# Altium project fader2_pcb.PrjPcb (part 2 of 2)

## Sheet Supplies_Pots.SchDoc
size 228 x 279 mm
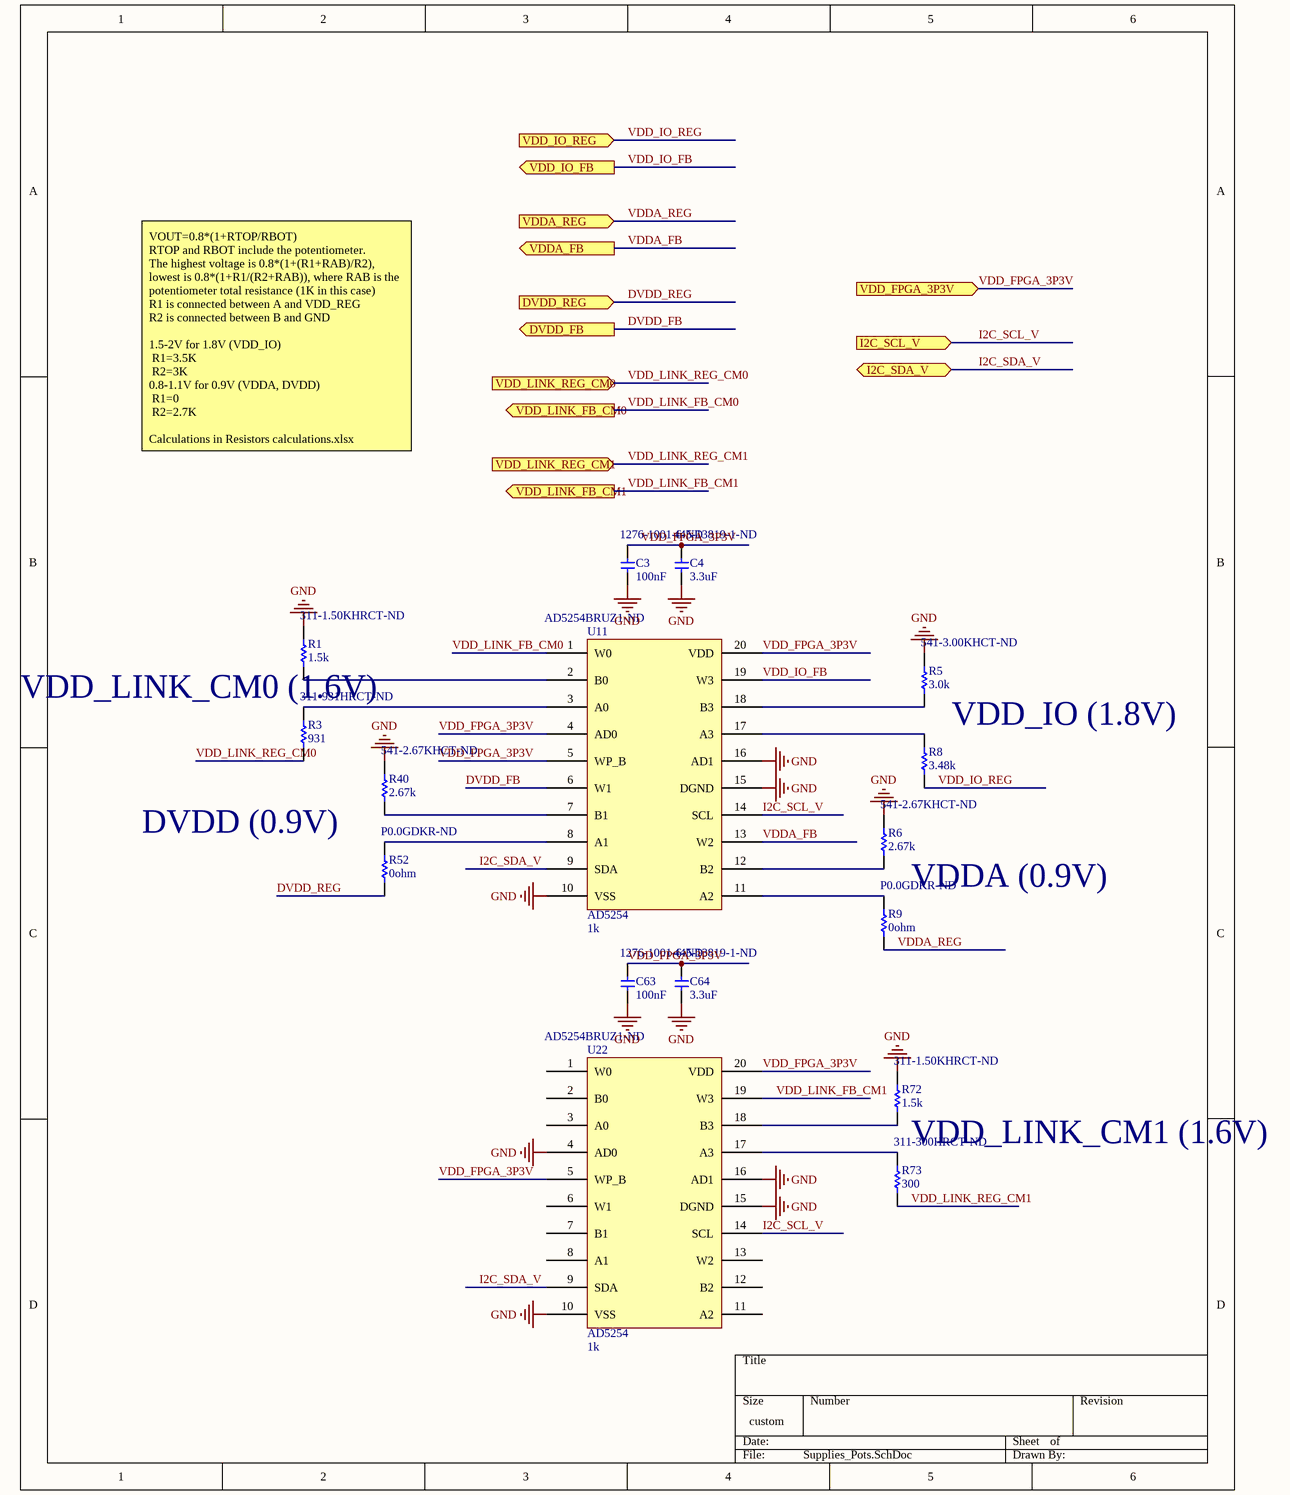
[diagram p9: Supplies_Pots.SchDoc]

### Parts
C3  100nF  Supplier Part Number 1: 1276-1001-6-ND  [CAP_0402]
C4  3.3uF  Supplier Part Number 1: 445-13819-1-ND  [CAP_0402]
C63  100nF  Supplier Part Number 1: 1276-1001-6-ND  [CAP_0402]
C64  3.3uF  Supplier Part Number 1: 445-13819-1-ND  [CAP_0402]
R1  1.5k  Supplier Part Number 1: 311-1.50KHRCT-ND  [RES_0603]
R3  931  Supplier Part Number 1: 311-931HRCT-ND  [RES_0603]
R5  3.0k  Supplier Part Number 1: 541-3.00KHCT-ND  [RES_0603]
R6  2.67k  Supplier Part Number 1: 541-2.67KHCT-ND  [RES_0603]
R8  3.48k  [RES_0603]
R9  0ohm  Supplier Part Number 1: P0.0GDKR-ND  [RES_0603]
R40  2.67k  Supplier Part Number 1: 541-2.67KHCT-ND  [RES_0603]
R52  0ohm  Supplier Part Number 1: P0.0GDKR-ND  [RES_0603]
R72  1.5k  Supplier Part Number 1: 311-1.50KHRCT-ND  [RES_0603]
R73  300  Supplier Part Number 1: 311-300HRCT-ND  [RES_0603]
U11  AD5254  Resistance: 1k  Supplier Part Number 1: AD5254BRUZ1-ND  [AD5254]
U22  AD5254  Resistance: 1k  Supplier Part Number 1: AD5254BRUZ1-ND  [AD5254]

### Ports
DVDD_FB (out), DVDD_REG (in), I2C_SCL_V (in), I2C_SDA_V (bidir), VDD_FPGA_3P3V (in), VDD_IO_FB (out), VDD_IO_REG (in), VDD_LINK_FB_CM0 (out), VDD_LINK_FB_CM1 (out), VDD_LINK_REG_CM0 (in), VDD_LINK_REG_CM1 (in), VDDA_FB (out), VDDA_REG (in)

### Nets
GND: C3.2 C4.2 C63.2 C64.2 R1.1(TOP) R5.1(TOP) R6.1(TOP) R40.1(TOP) R72.1(TOP) U11.10(VSS) U11.15(DGND) U11.16(AD1) U22.4(AD0) U22.10(VSS) U22.15(DGND) U22.16(AD1)
DVDD_FB: U11.6(W1) ; port DVDD_FB
DVDD_REG: R52.2(BOT) ; port DVDD_REG
I2C_SCL_V: U11.14(SCL) U22.14(SCL) ; port I2C_SCL_V
I2C_SDA_V: U11.9(SDA) U22.9(SDA) ; port I2C_SDA_V
VDD_FPGA_3P3V: C3.1 C4.1 C63.1 C64.1 U11.4(AD0) U11.5(WP_B) U11.20(VDD) U22.5(WP_B) U22.20(VDD) ; port VDD_FPGA_3P3V
VDD_IO_FB: U11.19(W3) ; port VDD_IO_FB
VDD_IO_REG: R8.2(BOT) ; port VDD_IO_REG
VDD_LINK_FB_CM0: U11.1(W0) ; port VDD_LINK_FB_CM0  [project net VDD_LINK_FB]
VDD_LINK_FB_CM1: U22.19(W3) ; port VDD_LINK_FB_CM1
VDD_LINK_REG_CM0: R3.2(BOT) ; port VDD_LINK_REG_CM0
VDD_LINK_REG_CM1: R73.2(BOT) ; port VDD_LINK_REG_CM1
VDDA_FB: U11.13(W2) ; port VDDA_FB
VDDA_REG: R9.2(BOT) ; port VDDA_REG
NetR1_2: R1.2(BOT) U11.2(B0)
NetR3_1: R3.1(TOP) U11.3(A0)
NetR5_2: R5.2(BOT) U11.18(B3)
NetR6_2: R6.2(BOT) U11.12(B2)
NetR8_1: R8.1(TOP) U11.17(A3)
NetR9_1: R9.1(TOP) U11.11(A2)
NetR40_2: R40.2(BOT) U11.7(B1)
NetR52_1: R52.1(TOP) U11.8(A1)
NetR72_2: R72.2(BOT) U22.18(B3)
NetR73_1: R73.1(TOP) U22.17(A3)

Not connected (* = marked no-connect by the designer): U22 1(W0) 2(B0) 3(A0) 6(W1) 7(B1) 8(A1) 11(A2) 12(B2) 13(W2)

### Notes on the sheet
- VOUT=0.8*(1+RTOP/RBOT)
  RTOP and RBOT include the potentiometer.
  The highest voltage is 0.8*(1+(R1+RAB)/R2), lowest is 0.8*(1+R1/(R2+RAB)), where RAB is the potentiometer total resistance (1K in this case)
  R1 is connected between A and VDD_REG
  R2 is connected between B and GND
  1.5-2V for 1.8V (VDD_IO)
  R1=3.5K
  R2=3K
  0.8-1.1V for 0.9V (VDDA, DVDD)
  R1=0
  R2=2.7K
  Calculations in Resistors calculations.xlsx
- (near R1) VDD_LINK_CM0 (1.6V)
- VDD_IO (1.8V)
- DVDD (0.9V)
- VDDA (0.9V)
- VDD_LINK_CM1 (1.6V)

### Library data of the parts
C3 C63 = cap 100nF: CAP CER 0.1uF 10% 16V X7R 0402; Manufacturer: Samsung Electro-Mechanics; Manufacturer ID: CL05B104KO5NNNC; Digikey ID: 1276-1001-1-ND; Value: 0.1uF; Package: 0402; Supplier 1: Digi-Key
C4 C64 = cap 3p3uF: CAP CER 3.3uF 10% 10V X5R 0402; Manufacturer: TDK; Manufacturer ID: C1005X5R1A335K050BC; Digikey ID: 445-13819-1-ND; Value: 3.3uF; Package: 0402; Supplier 1: Digi-Key
R1 R72 = res 1.5 kOhm_1: RES SMD 1.5K OHM 1% 1/10W 0603; Package: 0603; Supplier 1: Digi-Key; Supplier 2: Arrow; Supplier Part Number 2: CRCW06031K50FKEA
R3 = res 931 Ohm_1: RES SMD 931 OHM 1% 1/10W 0603; Package: 0603; Supplier 1: Digi-Key; Supplier 2: Digi-Key; Supplier Part Number 2: 541-931HCT-ND
R5 = res 3 kOhm_1: RES SMD 3k OHM 1% 1/10W 0603; Package: 0603; Supplier 1: Digi-Key; Supplier 2: Digi-Key; Supplier Part Number 2: 311-3.00KHRCT-ND
R6 R40 = res 2.67 kOhm_1: RES SMD 2.67kOHM 1% 1/10W 0603; Package: 0603; Supplier 1: Digi-Key; Supplier 2: Digi-Key; Supplier Part Number 2: 311-2.67KHRCT-ND
R8 = res 3.48 kOhm_1: RES SMD 3.48kOHM 1% 1/10W 0603; Package: 0603; Supplier 1: Digi-Key; Supplier Part Number 1: 311-3.48KHRCT-ND; Supplier 2: Digi-Key; Supplier Part Number 2: 541-3.48KHCT-ND
R9 R52 = res 0 ohm 0603: RES SMD 0 OHM JUMPER 1/10W 0603; Manufacturer: Panasonic; Manufacturer ID: ERJ-3GEY0R00V; Digikey ID: P0.0GCT-ND; Package: 0603; Supplier 1: Digi-Key
R73 = res 300 Ohm_1: RES SMD 300 OHM 1% 1/10W 0603; Package: 0603; Supplier 1: Digi-Key; Supplier 2: Digi-Key; Supplier Part Number 2: 541-300HCT-ND
U11 U22 = AD5254: Digital Potentiometer 1k Ohm 4 Circuit 256 Taps I²C Interface 20-TSSOP; Manufacturer: Analog Devices; Manufacturer ID: AD5254BRUZ1; Digikey ID: AD5254BRUZ1-ND; Supplier 1: Digi-Key

## Sheet De_Embed.SchDoc
size A
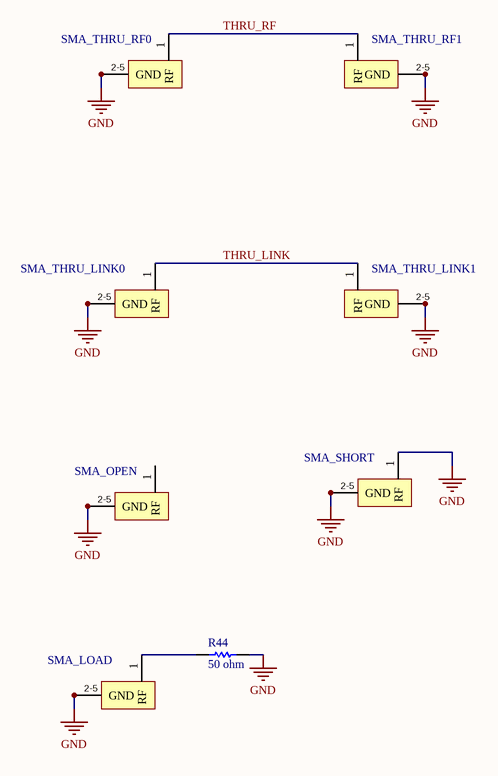
[diagram p10: De_Embed.SchDoc]

### Parts
R44  50 ohm  [RES_0402]
SMA_LOAD  CONSMA001-SMD-G  [CON-SMA-SMD]  (value not drawn)
SMA_OPEN  CONSMA001-SMD-G  [CON-SMA-SMD]  (value not drawn)
SMA_SHORT  CONSMA001-SMD-G  [CON-SMA-SMD]  (value not drawn)
SMA_THRU_LINK0  CONSMA001-SMD-G  [CON-SMA-SMD]  (value not drawn)
SMA_THRU_LINK1  CONSMA001-SMD-G  [CON-SMA-SMD]  (value not drawn)
SMA_THRU_RF0  CONSMA001-SMD-G  [CON-SMA-SMD]  (value not drawn)
SMA_THRU_RF1  CONSMA001-SMD-G  [CON-SMA-SMD]  (value not drawn)

### Nets
GND: R44.2(BOT) SMA_LOAD.2(GND) SMA_LOAD.3(GND) SMA_LOAD.4(GND) SMA_LOAD.5(GND) SMA_OPEN.2(GND) SMA_OPEN.3(GND) SMA_OPEN.4(GND) SMA_OPEN.5(GND) SMA_SHORT.1(RF) SMA_SHORT.2(GND) SMA_SHORT.3(GND) SMA_SHORT.4(GND) SMA_SHORT.5(GND) SMA_THRU_LINK0.2(GND) SMA_THRU_LINK0.3(GND) SMA_THRU_LINK0.4(GND) SMA_THRU_LINK0.5(GND) SMA_THRU_LINK1.2(GND) SMA_THRU_LINK1.3(GND) SMA_THRU_LINK1.4(GND) SMA_THRU_LINK1.5(GND) SMA_THRU_RF0.2(GND) SMA_THRU_RF0.3(GND) SMA_THRU_RF0.4(GND) SMA_THRU_RF0.5(GND) SMA_THRU_RF1.2(GND) SMA_THRU_RF1.3(GND) SMA_THRU_RF1.4(GND) SMA_THRU_RF1.5(GND)
THRU_LINK: SMA_THRU_LINK0.1(RF) SMA_THRU_LINK1.1(RF)
THRU_RF: SMA_THRU_RF0.1(RF) SMA_THRU_RF1.1(RF)
NetR44_1: R44.1(TOP) SMA_LOAD.1(RF)

Not connected (* = marked no-connect by the designer): SMA_OPEN 1(RF)

### Notes on the sheet
- (in symbol SURFACE MOUNT SMA CONNECTOR) 2-5

### Library data of the parts
R44 = res 50 ohm 0402: RES SMD 50 OHM 0.1% 1/20W 0402; Manufacturer: Vishay; Manufacturer ID: FC0402E50R0BST1; Package: 0402; Supplier 1: Digi-Key; Supplier Part Number 1: FC0402-50BWCT-ND; Resistance: 50 Ohm
SMA_LOAD SMA_OPEN SMA_SHORT SMA_THRU_LINK0 SMA_THRU_LINK1 SMA_THRU_RF0 SMA_THRU_RF1 = SURFACE MOUNT SMA CONNECTOR: SMD SMA CONNECTOR; Manufacturer 1: Linx Technologies; Supplier 1: Digi-Key; Supplier Part Number 1: CONSMA001-SMD-ND; Manufacturer Part Number 1: CONSMA001-SMD-G; Manufacturer Part Number 2: CONSMA002-SMD; Supplier Part Number 2: CONSMA002-SMD-ND

## Sheet BB_analog.SchDoc
size A
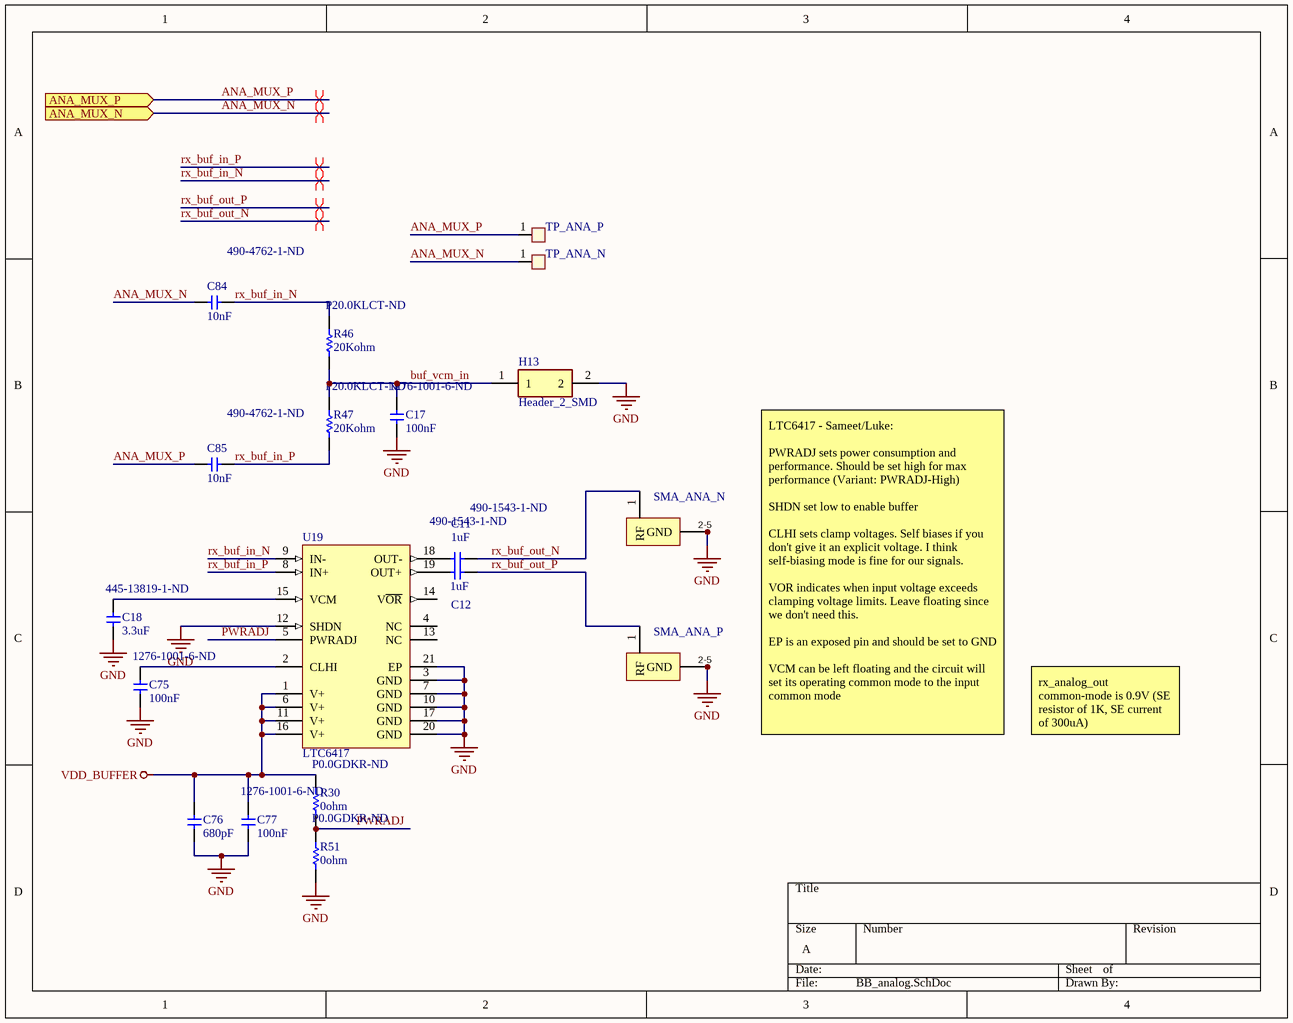
[diagram p11: BB_analog.SchDoc]

### Parts
C11  1uF  Supplier Part Number 1: 490-1543-1-ND  [CAP_0603]
C12  1uF  Supplier Part Number 1: 490-1543-1-ND  [CAP_0603]
C17  100nF  Supplier Part Number 1: 1276-1001-6-ND  [CAP_0402]
C18  3.3uF  Supplier Part Number 1: 445-13819-1-ND  [CAP_0402]
C75  100nF  Supplier Part Number 1: 1276-1001-6-ND  [CAP_0402]
C76  680pF  [CAP_0603]
C77  100nF  Supplier Part Number 1: 1276-1001-6-ND  [CAP_0402]
C84  10nF  Supplier Part Number 1: 490-4762-1-ND  [CAPC1005X06L_HD]
C85  10nF  Supplier Part Number 1: 490-4762-1-ND  [CAPC1005X06L_HD]
H13  Header_2_SMD  [HDR1X2_SMD_S]
R30  0ohm  Supplier Part Number 1: P0.0GDKR-ND  [RES_0603]
R46  20Kohm  Supplier Part Number 1: P20.0KLCT-ND  [RES_0402]
R47  20Kohm  Supplier Part Number 1: P20.0KLCT-ND  [RES_0402]
R51  0ohm  Supplier Part Number 1: P0.0GDKR-ND  [RES_0603]
SMA_ANA_N  CONSMA001-SMD-G  [CON-SMA-SMD]  (value not drawn)
SMA_ANA_P  CONSMA001-SMD-G  [CON-SMA-SMD]  (value not drawn)
TP_ANA_N  TestPoint_SMD  [TestPoint_SMD]  (value not drawn)
TP_ANA_P  TestPoint_SMD  [TestPoint_SMD]  (value not drawn)
U19  LTC6417  [LT-UDC-20_N_NPV]

### Ports
ANA_MUX_N (in), ANA_MUX_P (in)

### Nets
GND: C17.2 C18.2 C75.2 C76.2 C77.2 H13.2 R51.2(BOT) SMA_ANA_N.2(GND) SMA_ANA_N.3(GND) SMA_ANA_N.4(GND) SMA_ANA_N.5(GND) SMA_ANA_P.2(GND) SMA_ANA_P.3(GND) SMA_ANA_P.4(GND) SMA_ANA_P.5(GND) U19.3(GND) U19.7(GND) U19.10(GND) U19.12(SHDN) U19.17(GND) U19.20(GND) U19.21(EP)
VDD_BUFFER: C76.1 C77.1 R30.1(TOP) U19.1(V+) U19.6(V+) U19.11(V+) U19.16(V+)
ANA_MUX_N: C84.1 TP_ANA_N.1(TP) ; port ANA_MUX_N
ANA_MUX_P: C85.1 TP_ANA_P.1(TP) ; port ANA_MUX_P
buf_vcm_in: C17.1 H13.1 R46.2(BOT) R47.1(TOP)
PWRADJ: R30.2(BOT) R51.1(TOP) U19.5(PWRADJ)
rx_buf_in_N: C84.2 R46.1(TOP) U19.9(IN-)
rx_buf_in_P: C85.2 R47.2(BOT) U19.8(IN+)
rx_buf_out_N: C11.2 SMA_ANA_N.1(RF)
rx_buf_out_P: C12.1 SMA_ANA_P.1(RF)
NetC11_1: C11.1 U19.18(OUT-)
NetC12_2: C12.2 U19.19(OUT+)
NetC18_1: C18.1 U19.15(VCM)
NetC75_1: C75.1 U19.2(CLHI)

Not connected (* = marked no-connect by the designer): U19 4(NC) 13(NC) 14(V~{OR})

### Layout directives
differential pair: ANA_MUX_N, ANA_MUX_P, rx_buf_in_N, rx_buf_in_P, rx_buf_out_N, rx_buf_out_P

### Notes on the sheet
- LTC6417 - Sameet/Luke:
  PWRADJ sets power consumption and performance. Should be set high for max performance (Variant: PWRADJ-High)
  SHDN set low to enable buffer
  CLHI sets clamp voltages. Self biases if you don't give it an explicit voltage. I think self-biasing mode is fine for our signals.
  VOR indicates when input voltage exceeds clamping voltage limits. Leave floating since we don't need this.
  EP is an exposed pin and should be set to GND
  VCM can be left floating and the circuit will set its operating common mode to the input common mode
- rx_analog_out common-mode is 0.9V (SE resistor of 1K, SE current of 300uA)
- (in symbol SURFACE MOUNT SMA CONNECTOR) 2-5

### Library data of the parts
C11 C12 = cap 1uF 0603: CAP CER 1uF 10% 10V X5R 0603; Manufacturer: Murata; Manufacturer ID: GRM188R61A105KA61D; Digikey ID: 490-1543-1-ND; Value: 1uF; Package: 0603; Supplier 1: Digi-Key
C17 C75 C77 = cap 100nF: as C3 on sheet Supplies_Pots; Digikey ID: 1276-1001-1-ND; Value: 0.1uF; Package: 0402; Supplier 1: Digi-Key
C18 = cap 3p3uF: as C4 on sheet Supplies_Pots; Digikey ID: 445-13819-1-ND; Value: 3.3uF; Package: 0402; Supplier 1: Digi-Key
C76 = cap 680pF 0603: CAP CER 680pF 5% 25V C0G/NP0 0603; Manufacturer: Kemet; Manufacturer ID: C0603C681J3GACTU; Package: 0603; Supplier 1: Digi-Key; Supplier Part Number 1: 399-7949-1-ND; Capacitance: 680pF
C84 C85 = cap 10nF: CAP CER 10nF 10% 50V X7R 0402; Manufacturer: Murata; Manufacturer ID: GCM155R71H103KA55D; Value: 10000pF; Digikey ID: 490-4762-1-ND; Package: 0402; Supplier 1: Digi-Key
H13 = Header_2_SMD: Connector Header Vertical, SMD, 2 position 0.100" (2.54mm); Manufacturer_Name: SAMTEC; Manufacturer_Part_Number: TSM-102-01-S-SV; Datasheet Link: https://componentsearchengine.com/Datasheets/2/TSM-102-01-S-SV.pdf; Arrow Part Number: TSM-102-01-S-SV; Arrow Price/Stock: https://www.arrow.com/en/products/tsm-102-01-s-sv/samtec; Mouser Part Number: 200-TSM10201SSV; Mouser Price/Stock: https://www.mouser.co.uk/ProductDetail/Samtec/TSM-102-01-S-SV?qs=FESYatJ8odJNSemiJZ%2Fyzw%3D%3D; Supplier 1: Digi-Key; Supplier Part Number 1: SAM10783-ND
R30 R51 = res 0 ohm 0603: as R9 on sheet Supplies_Pots; Digikey ID: P0.0GCT-ND; Package: 0603; Supplier 1: Digi-Key
R46 R47 = res 20 Kohm: RES SMD 20k OHM 1% 1/10W 0402; Manufacturer: Panasonic; Manufacturer ID: ERJ-2RKF2002X; Digikey ID: P20.0KLCT-ND; Package: 0402; Supplier 1: Digi-Key
SMA_ANA_N SMA_ANA_P = SURFACE MOUNT SMA CONNECTOR: as SMA_LOAD on sheet De_Embed; Supplier 1: Digi-Key; Supplier Part Number 1: CONSMA001-SMD-ND; Manufacturer Part Number 1: CONSMA001-SMD-G; Manufacturer Part Number 2: CONSMA002-SMD; Supplier Part Number 2: CONSMA002-SMD-ND
TP_ANA_N TP_ANA_P = TestPoint_SMD: Test Point, SMD 1mm x 1.8mm, 1.15mm high.; Supplier 1: Digi-Key; Supplier Part Number 1: 952-2665-1-ND
U19 = LTC6417CUDC#PBF: Single Channel, Low Noise, High Linearity Differential Buffer / 16-Bit ADC Driver with Fast Clamp, 1600 MHz Typical GBW, 10000 V/us Typical SR, 4.75 to 5.25 V, 20-Pin QFN (UDC20), Commercial, Pb-Free; Manufacturer: Linear Technology; Channels (#): 1; GBW (MHz) Typical: 1600; Is (mA) Typical: 123; SR (V/us) Typical: 10000; Vos (mV) Typical: 0.1; Vs Max (V): 5.25; Vs Min (V): 4.75; PackageVersion: Rev Ø; PackageReference: LT-UDC-20; PackageDescription: 20-Lead Plastic QFN, Body 3 x 4 mm, Pitch 0.5 mm; Supplier 1: Digi-Key; Supplier Part Number 1: LTC6417CUDC#PBF-ND; Supplier 2: Farnell; Supplier Part Number 2: 2322431; Supplier 3: Newark; Supplier Part Number 3: 27W9503; Linear Technology Part Number: LTC6417; RoHS: Pb-Free; Type: DIFF; Mounting Technology: Surface Mount; PartNumber: LTC6417CUDC#PBF; ComponentLink1Description: Manufacturer URL; ComponentLink1URL: http://www.linear.com/; ComponentLink2Description: Datasheet; ComponentLink2URL: http://cds.linear.com/docs/en/datasheet/6417f.pdf; ComponentLink3Description: Package Specification; ComponentLink3URL: http://cds.linear.com/docs/en/packaging/QFN_20_05-08-1742.pdf; Digikey ID: LTC6417CUDC#PBF-ND; Manufacturer ID: LTC6417CUDC#PBF

## Nets that join several sheets
GND: Top (14 pins), SMA_RF_CLK (98 pins), FPGA_interface (C10.2 J1.19 J1.20), Lvl_Shifters (13 pins), Supplies_LDOs (65 pins), Supplies_Isense (23 pins), Supplies_Pots (16 pins), De_Embed (30 pins), BB_analog (22 pins)
VDD_BUFFER: Supplies_LDOs (5 pins), BB_analog (7 pins)
VDD_IN: Top (6 pins), Supplies_LDOs (29 pins)
DVDD_FB: Supplies_LDOs (U3.16), Supplies_Pots (U11.6)
DVDD_REG: Supplies_LDOs (6 pins), Supplies_Isense (U9.2), Supplies_Pots (R52.2)
DVDD_RS: Supplies_LDOs (5 pins), Supplies_Isense (U9.3)
I2C_SCL_I: Lvl_Shifters (R13.2 U5.7), Supplies_Isense (5 pins)
I2C_SCL_I_FPGA: FPGA_interface (J1.17), Lvl_Shifters (R11.2 U5.2)
I2C_SCL_V: Lvl_Shifters (R17.2 U6.7), Supplies_Pots (U11.14 U22.14)
I2C_SCL_V_FPGA: FPGA_interface (J1.18), Lvl_Shifters (R15.2 U6.2)
I2C_SDA_I: Lvl_Shifters (R14.2 U5.6), Supplies_Isense (5 pins)
I2C_SDA_I_FPGA: FPGA_interface (J1.15), Lvl_Shifters (R12.2 U5.3)
I2C_SDA_V: Lvl_Shifters (R18.2 U6.6), Supplies_Pots (U11.9 U22.9)
I2C_SDA_V_FPGA: FPGA_interface (J1.16), Lvl_Shifters (R16.2 U6.3)
RESET: Top (H9.8), Lvl_Shifters (U4.12)
RESET_FPGA: FPGA_interface (J1.6), Lvl_Shifters (U4.2)
SCAN_CLK: Top (H9.2), Lvl_Shifters (U4.8)
SCAN_CLK_FPGA: FPGA_interface (J1.12), Lvl_Shifters (U4.5)
SCAN_EN: Top (H9.4), Lvl_Shifters (U4.10)
SCAN_EN_FPGA: FPGA_interface (J1.10), Lvl_Shifters (U4.4)
SCAN_IN: Top (H9.6), Lvl_Shifters (U4.11)
SCAN_IN_FPGA: FPGA_interface (J1.8), Lvl_Shifters (U4.3)
SCAN_OUT: Top (H9.12), Lvl_Shifters (U7.2)
SCAN_OUT_FPGA: FPGA_interface (J1.4), Lvl_Shifters (U7.12)
VDD_FPGA_3P3V: SMA_RF_CLK (H7.3), FPGA_interface (C10.1 H19.1 J1.1 J1.2), Lvl_Shifters (8 pins), Supplies (H20.1 H20.2), Supplies_LDOs (15 pins), Supplies_Isense (18 pins), Supplies_Pots (9 pins)
VDD_IO: SMA_RF_CLK (H7.1), Lvl_Shifters (C14.1 C65.1 U4.13 U7.1), Supplies_LDOs (5 pins)
VDD_IO_FB: Supplies_LDOs (U12.16), Supplies_Pots (U11.19)
VDD_IO_REG: Supplies_LDOs (6 pins), Supplies_Isense (U10.2), Supplies_Pots (R8.2)
VDD_IO_RS: Supplies_LDOs (5 pins), Supplies_Isense (U10.3)
VDD_LINK_FB: Supplies_LDOs (U16.16), Supplies_Pots (U11.1)
VDD_LINK_FB_CM1: Supplies_LDOs (U21.16), Supplies_Pots (U22.19)
VDD_LINK_REG_CM0: Supplies_LDOs (6 pins), Supplies_Isense (U32.2), Supplies_Pots (R3.2)
VDD_LINK_REG_CM1: Supplies_LDOs (6 pins), Supplies_Isense (U33.2), Supplies_Pots (R73.2)
VDD_LINK_RS_CM0: Supplies_LDOs (5 pins), Supplies_Isense (U32.3)
VDD_LINK_RS_CM1: Supplies_LDOs (5 pins), Supplies_Isense (U33.3)
VDD_SCAN_FPGA: FPGA_interface (H19.2), Lvl_Shifters (10 pins)
VDDA_FB: Supplies_LDOs (U1.16), Supplies_Pots (U11.13)
VDDA_REG: Supplies_LDOs (6 pins), Supplies_Isense (U8.2), Supplies_Pots (R9.2)
VDDA_RS: Supplies_LDOs (5 pins), Supplies_Isense (U8.3)

## Assembly variants
PWRADJ-High: not fitted R51